# Altium schematic sheet RGB_Camera.SchDoc
size A4
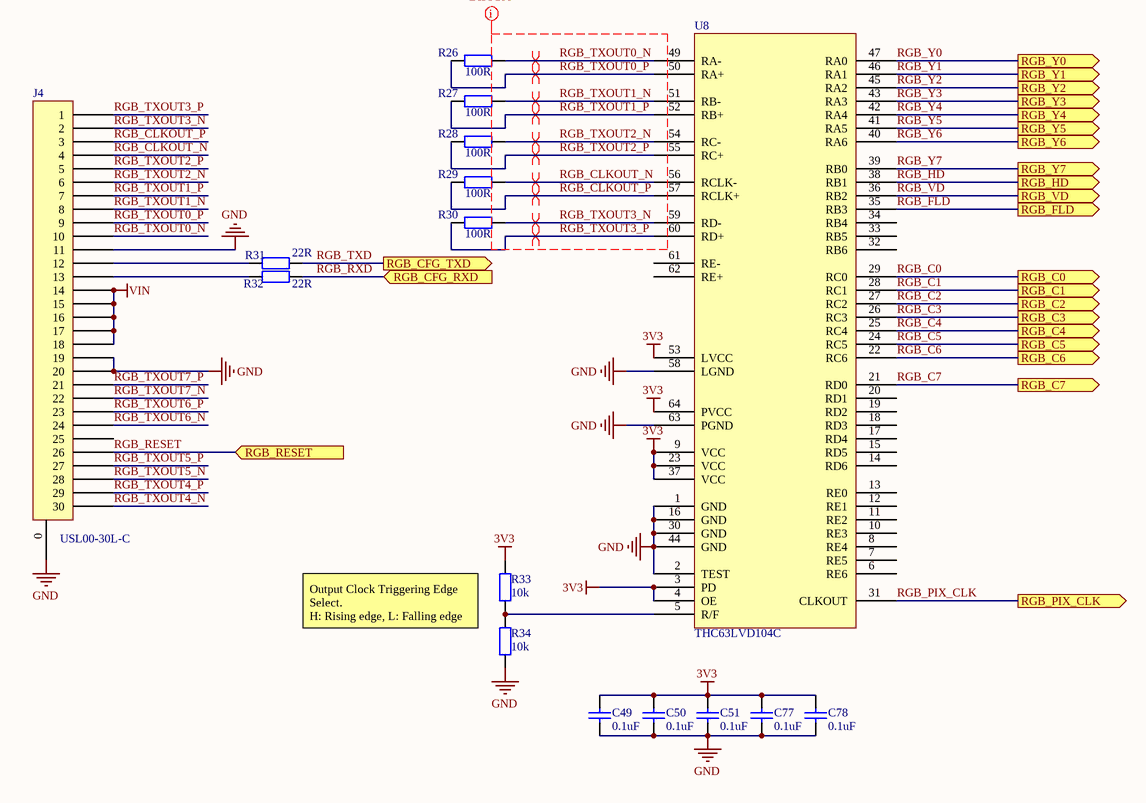
[diagram p0: RGB_Camera.SchDoc]

## Parts
C49  Capacitance: 0.1uF  [0402C_M]  (hidden comment: GRM155R71C104KA88D)
C50  Capacitance: 0.1uF  [0402C_M]  (hidden comment: GRM155R71C104KA88D)
C51  Capacitance: 0.1uF  [0402C_M]  (hidden comment: GRM155R71C104KA88D)
C77  Capacitance: 0.1uF  [0402C_M]  (hidden comment: GRM155R71C104KA88D)
C78  Capacitance: 0.1uF  [0402C_M]  (hidden comment: GRM155R71C104KA88D)
J4  USL00-30L-C  [USL00-30L-C]
R26  value 100R  [0402R_M]  (hidden comment: CRCW0402100RFKEE)
R27  value 100R  [0402R_M]  (hidden comment: CRCW0402100RFKEE)
R28  value 100R  [0402R_M]  (hidden comment: CRCW0402100RFKEE)
R29  value 100R  [0402R_M]  (hidden comment: CRCW0402100RFKEE)
R30  value 100R  [0402R_M]  (hidden comment: CRCW0402100RFKEE)
R31  Resistance: 22R  [0402R_M]  (hidden comment: CRCW040222R0JNED)
R32  Resistance: 22R  [0402R_M]  (hidden comment: CRCW040222R0JNED)
R33  value 10k  [0402R_M]  (hidden comment: CRCW040210K0FKED)
R34  value 10k  [0402R_M]  (hidden comment: CRCW040210K0FKED)
U8  THC63LVD104C  [THC_LQFP64_L]

## Ports
RGB_C0 (out), RGB_C1 (out), RGB_C2 (out), RGB_C3 (out), RGB_C4 (out), RGB_C5 (out), RGB_C6 (out), RGB_C7 (out), RGB_CFG_RXD (in), RGB_CFG_TXD (out), RGB_FLD (out), RGB_HD (out), RGB_PIX_CLK (out), RGB_RESET (in), RGB_VD (out), RGB_Y0 (out), RGB_Y1 (out), RGB_Y2 (out), RGB_Y3 (out), RGB_Y4 (out), RGB_Y5 (out), RGB_Y6 (out), RGB_Y7 (out)

## Nets
3V3: C49.2 C50.2 C51.2 C77.2 C78.2 R33.2 U8.3(PD) U8.4(OE) U8.9(VCC) U8.23(VCC) U8.37(VCC) U8.53(LVCC) U8.64(PVCC)
GND: C49.1 C50.1 C51.1 C77.1 C78.1 J4.0 J4.11 J4.19 J4.20 R34.1 U8.1(GND) U8.2(TEST) U8.16(GND) U8.30(GND) U8.44(GND) U8.58(LGND) U8.63(PGND)
VIN: J4.14 J4.15 J4.16 J4.17 J4.18
RGB_C0: U8.29(RC0) ; port RGB_C0
RGB_C1: U8.28(RC1) ; port RGB_C1
RGB_C2: U8.27(RC2) ; port RGB_C2
RGB_C3: U8.26(RC3) ; port RGB_C3
RGB_C4: U8.25(RC4) ; port RGB_C4
RGB_C5: U8.24(RC5) ; port RGB_C5
RGB_C6: U8.22(RC6) ; port RGB_C6
RGB_C7: U8.21(RD0) ; port RGB_C7
RGB_CLKOUT_N: J4.4 R29.2 U8.56(RCLK-)
RGB_CLKOUT_P: J4.3 R29.1 U8.57(RCLK+)
RGB_FLD: U8.35(RB3) ; port RGB_FLD
RGB_HD: U8.38(RB1) ; port RGB_HD
RGB_PIX_CLK: U8.31(CLKOUT) ; port RGB_PIX_CLK
RGB_RESET: J4.26 ; port RGB_RESET
RGB_RXD: R32.2 ; port RGB_CFG_RXD
RGB_TXD: R31.2 ; port RGB_CFG_TXD
RGB_TXOUT0_N: J4.10 R26.2 U8.49(RA-)
RGB_TXOUT0_P: J4.9 R26.1 U8.50(RA+)
RGB_TXOUT1_N: J4.8 R27.2 U8.51(RB-)
RGB_TXOUT1_P: J4.7 R27.1 U8.52(RB+)
RGB_TXOUT2_N: J4.6 R28.2 U8.54(RC-)
RGB_TXOUT2_P: J4.5 R28.1 U8.55(RC+)
RGB_TXOUT3_N: J4.2 R30.2 U8.59(RD-)
RGB_TXOUT3_P: J4.1 R30.1 U8.60(RD+)
RGB_TXOUT4_N: J4.30
RGB_TXOUT4_P: J4.29
RGB_TXOUT5_N: J4.28
RGB_TXOUT5_P: J4.27
RGB_TXOUT6_N: J4.24
RGB_TXOUT6_P: J4.23
RGB_TXOUT7_N: J4.22
RGB_TXOUT7_P: J4.21
RGB_VD: U8.36(RB2) ; port RGB_VD
RGB_Y0: U8.47(RA0) ; port RGB_Y0
RGB_Y1: U8.46(RA1) ; port RGB_Y1
RGB_Y2: U8.45(RA2) ; port RGB_Y2
RGB_Y3: U8.43(RA3) ; port RGB_Y3
RGB_Y4: U8.42(RA4) ; port RGB_Y4
RGB_Y5: U8.41(RA5) ; port RGB_Y5
RGB_Y6: U8.40(RA6) ; port RGB_Y6
RGB_Y7: U8.39(RB0) ; port RGB_Y7
NetJ4_12: J4.12 R31.1
NetJ4_13: J4.13 R32.1
NetR33_1: R33.1 R34.2 U8.5(R/F)

Not connected (* = marked no-connect by the designer): J4 25; U8 6(RE6) 7(RE5) 8(RE4) 10(RE3) 11(RE2) 12(RE1) 13(RE0) 14(RD6) 15(RD5) 17(RD4) 18(RD3) 19(RD2) 20(RD1) 32(RB6) 33(RB5) 34(RB4) 61(RE-) 62(RE+)

## Layout directives
differential pair: RGB_CLKOUT_N, RGB_CLKOUT_P, RGB_TXOUT0_N, RGB_TXOUT0_P, RGB_TXOUT1_N, RGB_TXOUT1_P, RGB_TXOUT2_N, RGB_TXOUT2_P, RGB_TXOUT3_N, RGB_TXOUT3_P
net class DIFF100: RGB_CLKOUT_N, RGB_CLKOUT_P, RGB_TXOUT0_N, RGB_TXOUT0_P, RGB_TXOUT1_N, RGB_TXOUT1_P, RGB_TXOUT2_N, RGB_TXOUT2_P, RGB_TXOUT3_N, RGB_TXOUT3_P

## Notes on the sheet
- Output Clock Triggering Edge Select.
  H: Rising edge, L: Falling edge

## Library data of the parts
C49-C51 C77 C78 = GRM155R71C104KA88D: CAP CER 0.1UF 16V X7R 0402; Manufacturer: Murata Electronics North America; Tolerance: ±10%; Supplier 1: Digi-Key; Manufacturer Part Number: GRM155R71C104KA88D; RoHS: RoHS Compliant; Category: Capacitors; Stock 1: 58190082; Pricing 1: 1=0.1, 10=0.013, 100=0.0059, 500=0.00422, 1000=0.00332, 2500=0.00302, 5000=0.00278 (USD); Packaging: Cut Tape (CT); Part Status: Active; Voltage - Rated: 16V; Temperature Coefficient: X7R; Operating Temperature: -55°C ~ 125°C; Features: -; Ratings: -; Applications: General Purpose; Mounting Type: Surface Mount, MLCC; Package / Case: 0402 (1005 Metric); Size / Dimension: 0.039" L x 0.020" W (1.00mm x 0.50mm); Height - Seated (Max): -; Thickness (Max): 0.022" (0.55mm); Lead Spacing: -; Lead Style: -; ComponentLink1URL: http://www.murata.com/~/media/webrenewal/support/library/catalog/products/capacitor/mlcc/c02e.ashx; ComponentLink1Description: http://www.murata.com/~/media/webrenewal/support/library/catalog/products/capacitor/mlcc/c02e.ashx; Supplier Part Number 1: 490-3261-1-ND
R26-R30 = CRCW0402100RFKEE: RES SMD 100 OHM 1% 1/16W 0402; Manufacturer: Vishay Dale; Power (Watts): 0.063W, 1/16W; Temperature Coefficient: ±100ppm/°C; Supplier 1: Digi-Key; Manufacturer Part Number: CRCW0402100RFKEE; RoHS: RoHS Compliant; Category: Resistors; Stock 1: 2176; Pricing 1: 1=0.1, 10=0.037, 100=0.0149, 1000=0.0067, 2500=0.00582, 5000=0.00481 (USD); Packaging: Cut Tape (CT); Part Status: Active; Tolerance: ±1%; Composition: Thick Film; Features: Automotive AEC-Q200; Operating Temperature: -55°C ~ 155°C; Package / Case: 0402 (1005 Metric); Supplier Device Package: 0402; Size / Dimension: 0.039" L x 0.020" W (1.00mm x 0.50mm); Height - Seated (Max): 0.016" (0.40mm); Failure Rate: -; ComponentLink1URL: http://www.vishay.com/docs/20035/dcrcwe3.pdf; ComponentLink1Description: http://www.vishay.com/docs/20035/dcrcwe3.pdf; Supplier Part Number 1: 541-2953-1-ND
R31 R32 = CRCW040222R0JNED: RES SMD 22 OHM 5% 1/16W 0402; Manufacturer: Vishay / Dale; Power Rating: 63 mW; Temperature Coefficient: 200 PPM / K; Voltage Rating: 50 V; Unit Weight: 0.000023 oz; Supplier 1: Digi-Key; Manufacturer Part Number: CRCW040222R0JNED; Stock 1: 238592; Pricing 1: 1=0.1, 10=0.025, 100=0.01, 1000=0.0045, 2500=0.0039, 5000=0.0032 (USD); Product Category: Thick Film Resistors - SMD; RoHS: Details; Brand: Vishay / Dale; Tolerance: 5 %; Case Code - in: 0402; Case Code - mm: 1005; Operating Temperature Range: - 55 C to + 155 C; Series: CRCW; Height: 0.35 mm; Length: 1 mm; Package / Case: 0402 (1005 metric); Packaging: Reel; Product: Thick Film Resistors SMD; Factory Pack Quantity: 10000; Termination Style: SMD/SMT; Width: 0.5 mm; ComponentLink1URL: https://datasheet.ciiva.com/16429/dcrcwe3-16429946.pdf; ComponentLink1Description: https://datasheet.ciiva.com/16429/dcrcwe3-16429946.pdf; ComponentLink2URL: https://datasheet.ciiva.com/8882/dcrcwe3-8882922.pdf; ComponentLink2Description: https://datasheet.ciiva.com/8882/dcrcwe3-8882922.pdf; ComponentLink3URL: https://datasheet.ciiva.com/16770/70201119-16770509.pdf; ComponentLink3Description: https://datasheet.ciiva.com/16770/70201119-16770509.pdf; ComponentLink4URL: https://datasheet.ciiva.com/3256/dcrcwe3-3256251.pdf; ComponentLink4Description: https://datasheet.ciiva.com/3256/dcrcwe3-3256251.pdf; ComponentLink5URL: https://datasheet.ciiva.com/2462/dcrcwe3-2462055.pdf; ComponentLink5Description: https://datasheet.ciiva.com/2462/dcrcwe3-2462055.pdf; ComponentLink6URL: https://datasheet.ciiva.com/7743/dcrcwe3-7743525.pdf; ComponentLink6Description: https://datasheet.ciiva.com/7743/dcrcwe3-7743525.pdf; ComponentLink7URL: https://datasheet.ciiva.com/2462/dcrcwe3-2462057.pdf; ComponentLink7Description: https://datasheet.ciiva.com/2462/dcrcwe3-2462057.pdf; ComponentLink8URL: https://datasheet.ciiva.com/2462/dcrcwe3-2462056.pdf; ComponentLink8Description: https://datasheet.ciiva.com/2462/dcrcwe3-2462056.pdf; Supplier Part Number 1: 541-22JCT-ND
R33 R34 = CRCW040210K0FKED: RES SMD 10K OHM 1% 1/16W 0402; Manufacturer: Vishay Dale; Power (Watts): 0.063W, 1/16W; Temperature Coefficient: ±100ppm/°C; Supplier 1: Digi-Key; Manufacturer Part Number: CRCW040210K0FKED; RoHS: RoHS Compliant; Category: Resistors; Stock 1: 0; Pricing 1: 1=0.1, 10=0.037, 100=0.0149, 1000=0.0067, 2500=0.00582, 5000=0.00481 (USD); Packaging: Cut Tape (CT); Part Status: Active; Tolerance: ±1%; Composition: Thick Film; Features: Automotive AEC-Q200; Operating Temperature: -55°C ~ 155°C; Package / Case: 0402 (1005 Metric); Supplier Device Package: 0402; Size / Dimension: 0.039" L x 0.020" W (1.00mm x 0.50mm); Height - Seated (Max): 0.016" (0.40mm); Failure Rate: -; ComponentLink1URL: http://www.vishay.com/docs/20035/dcrcwe3.pdf; ComponentLink1Description: http://www.vishay.com/docs/20035/dcrcwe3.pdf; Supplier Part Number 1: 541-10.0KLCT-ND
U8 = THC63LVD104C: IC DESERIALIZER SNGL LVDS 64TQFP; Manufacturer: CEL; Data Rate: 784Mbps; Output Type: CMOS/TTL; Number of Inputs: 5; Number of Outputs: 35; Voltage - Supply: 3 V ~ 3.6 V; Supplier 1: Digi-Key; Manufacturer Part Number: THC63LVD104C; RoHS: RoHS Compliant; Category: Integrated Circuits (ICs); Stock 1: 1654; Pricing 1: 1=12.28, 10=11.048, 25=10.0656, 100=9.0835, 250=8.347, 500=7.6105, 1000=6.6285 (USD); Packaging: Tray; Part Status: Active; Function: Deserializer; Input Type: LVDS; Operating Temperature: -20°C ~ 85°C (TA); Mounting Type: Surface Mount; Package / Case: 64-TQFP; Supplier Device Package: 64-TQFP (10x10); ComponentLink1URL: http://www.cel.com/pdf/datasheets/THC63LVD104C.pdf; ComponentLink1Description: http://www.cel.com/pdf/datasheets/THC63LVD104C.pdf; Supplier Part Number 1: THC63LVD104C-ND